# Altium schematic sheet mcu.SchDoc: MCU
size A3; Organization: Altium Limited; Address1: L3, 12a Rodborough Rd; Address2: Frenchs Forest; Address3: NSW; Address4: Australia 2086
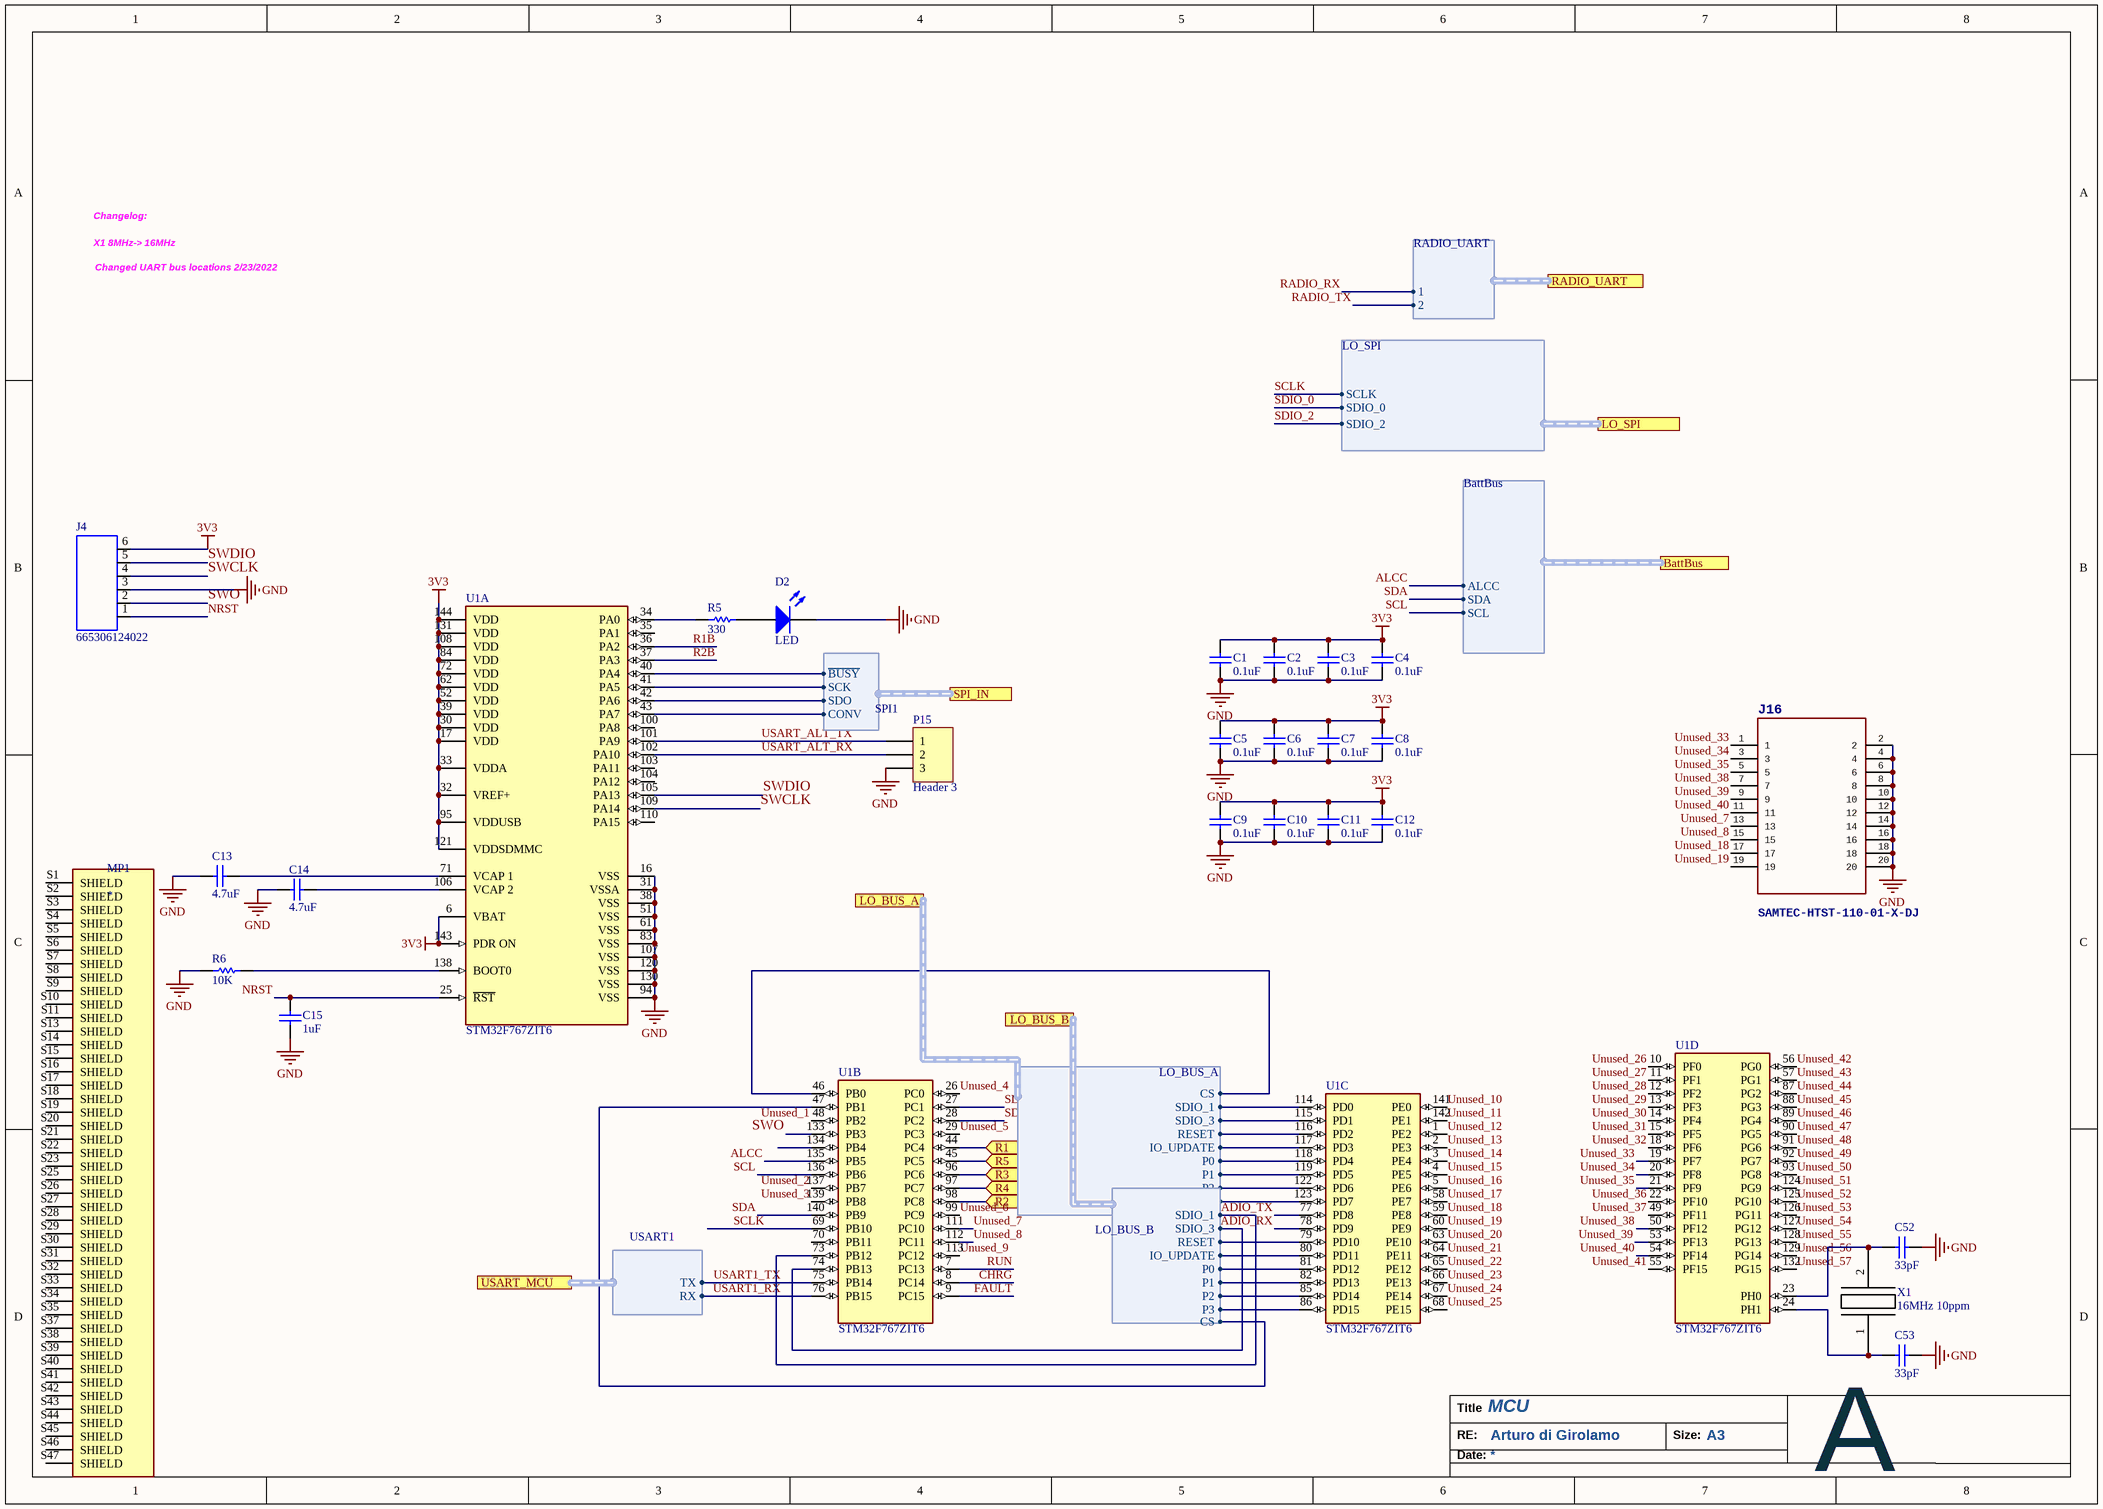
[diagram p0: mcu.SchDoc]

## Parts
C1  0.1uF  [0402_Cap]
C2  0.1uF  [0402_Cap]
C3  0.1uF  [0402_Cap]
C4  0.1uF  [0402_Cap]
C5  0.1uF  [0402_Cap]
C6  0.1uF  [0402_Cap]
C7  0.1uF  [0402_Cap]
C8  0.1uF  [0402_Cap]
C9  0.1uF  [0402_Cap]
C10  0.1uF  [0402_Cap]
C11  0.1uF  [0402_Cap]
C12  0.1uF  [0402_Cap]
C13  4.7uF  [0402_Cap]
C14  4.7uF  [0402_Cap]
C15  1uF  [0402_Cap]
C52  33pF  [0402_Cap]
C53  33pF  [0402_Cap]
D2  LED  [STD_LED]
J4  665306124022  [6pin_we]
J16  SAMTEC-HTST-110-01-X-DJ  [SAMTEC-HTST-110-01-X-D]
MP1  *  [WURTH_36103605S]
P15  Header 3  [HDR1X3]
R5  330  [0402_Res]
R6  10K  [0402_Res]
U1  STM32F767ZIT6  [FP-LQFP144-1A-MFG]  (parts A,B,C,D of 4)
X1  16MHz 10ppm  [XTAL_ECS-160-20-4X]

## Ports
BattBus (harness BattBus), LO_BUS_A (harness LO_BUS_A), LO_BUS_B (harness LO_BUS_B), LO_SPI (harness LO_SPI), R1 (in), R2 (in), R3 (in), R4 (in), R5 (in), RADIO_UART (harness RADIO_UART), SPI_IN (harness SPI1), USART_MCU (harness USART1)

## Harnesses
USART1: TX, RX
SPI1: ~{BUSY}, SCK, CONV, SDO
LO_BUS_A: P2, P1, P0, IO_UPDATE, RESET, SDIO_3, SDIO_1, P3, CS
LO_BUS_B: P2, P1, P0, IO_UPDATE, RESET, SDIO_3, SDIO_1, CS, P3
RADIO_UART: 1, 2
LO_SPI: SDIO_2, SDIO_0, SCLK
BattBus: ALCC, SDA, SCL

## Nets
3V3: C1.2 C2.2 C3.2 C4.2 C5.2 C6.2 C7.2 C8.2 C9.2 C10.2 C11.2 C12.2 J4.6 U1.6(VBAT) U1.17(VDD) U1.30(VDD) U1.32(VREF+) U1.33(VDDA) U1.39(VDD) U1.52(VDD) U1.62(VDD) U1.72(VDD) U1.84(VDD) U1.95(VDDUSB) U1.108(VDD) U1.121(VDDSDMMC) U1.131(VDD) U1.143(PDR_ON) U1.144(VDD)
GND: C1.1 C2.1 C3.1 C4.1 C5.1 C6.1 C7.1 C8.1 C9.1 C10.1 C11.1 C12.1 C13.1 C14.1 C15.1 C52.2 C53.2 D2.2 J4.3 J16.2 J16.4 J16.6 J16.8 J16.10 J16.12 J16.14 J16.16 J16.18 J16.20 P15.3 R6.1 U1.16(VSS) U1.31(VSSA) U1.38(VSS) U1.51(VSS) U1.61(VSS) U1.83(VSS) U1.94(VSS) U1.107(VSS) U1.120(VSS) U1.130(VSS)
ALCC: U1.135(PB5) ; port BattBus.ALCC
CHRG: U1.8(PC14)
FAULT: U1.9(PC15)
NRST: C15.2 J4.1 U1.25(~{RST})
R1: U1.44(PC4) ; port R1
R1B: U1.36(PA2)
R2: U1.98(PC8) ; port R2
R2B: U1.37(PA3)
R3: U1.96(PC6) ; port R3
R4: U1.97(PC7) ; port R4
R5: U1.45(PC5) ; port R5
RADIO_RX: U1.78(PD9) ; port RADIO_UART.1
RADIO_TX: U1.77(PD8) ; port RADIO_UART.2
RUN: U1.7(PC13)
SCL: U1.136(PB6) ; port BattBus.SCL
SCLK: U1.69(PB10) ; port LO_SPI.SCLK
SDA: U1.140(PB9) ; port BattBus.SDA
SDIO_0: U1.27(PC1) ; port LO_SPI.SDIO_0
SDIO_2: U1.28(PC2) ; port LO_SPI.SDIO_2
SWCLK: J4.4 U1.109(PA14)
SWDIO: J4.5 U1.105(PA13)
SWO: J4.2 U1.133(PB3)
Unused_1: U1.48(PB2)
Unused_2: U1.137(PB7)
Unused_3: U1.139(PB8)
Unused_4: U1.26(PC0)
Unused_5: U1.29(PC3)
Unused_6: U1.99(PC9)
Unused_7: J16.13 U1.111(PC10)
Unused_8: J16.15 U1.112(PC11)
Unused_9: U1.113(PC12)
Unused_10: U1.141(PE0)
Unused_11: U1.142(PE1)
Unused_12: U1.1(PE2)
Unused_13: U1.2(PE3)
Unused_14: U1.3(PE4)
Unused_15: U1.4(PE5)
Unused_16: U1.5(PE6)
Unused_17: U1.58(PE7)
Unused_18: J16.17 U1.59(PE8)
Unused_19: J16.19 U1.60(PE9)
Unused_20: U1.63(PE10)
Unused_21: U1.64(PE11)
Unused_22: U1.65(PE12)
Unused_23: U1.66(PE13)
Unused_24: U1.67(PE14)
Unused_25: U1.68(PE15)
Unused_26: U1.10(PF0)
Unused_27: U1.11(PF1)
Unused_28: U1.12(PF2)
Unused_29: U1.13(PF3)
Unused_30: U1.14(PF4)
Unused_31: U1.15(PF5)
Unused_32: U1.18(PF6)
Unused_33: J16.1 U1.19(PF7)
Unused_34: J16.3 U1.20(PF8)
Unused_35: J16.5 U1.21(PF9)
Unused_36: U1.22(PF10)
Unused_37: U1.49(PF11)
Unused_38: J16.7 U1.50(PF12)
Unused_39: J16.9 U1.53(PF13)
Unused_40: J16.11 U1.54(PF14)
Unused_41: U1.55(PF15)
Unused_42: U1.56(PG0)
Unused_43: U1.57(PG1)
Unused_44: U1.87(PG2)
Unused_45: U1.88(PG3)
Unused_46: U1.89(PG4)
Unused_47: U1.90(PG5)
Unused_48: U1.91(PG6)
Unused_49: U1.92(PG7)
Unused_50: U1.93(PG8)
Unused_51: U1.124(PG9)
Unused_52: U1.125(PG10)
Unused_53: U1.126(PG11)
Unused_54: U1.127(PG12)
Unused_55: U1.128(PG13)
Unused_56: U1.129(PG14)
Unused_57: U1.132(PG15)
USART1_RX: U1.76(PB15) ; port USART_MCU.RX
USART1_TX: U1.75(PB14) ; port USART_MCU.TX
USART_ALT_RX: P15.2 U1.102(PA10)
USART_ALT_TX: P15.1 U1.101(PA9)
NetC13_2: C13.2 U1.71(VCAP_1)
NetC14_2: C14.2 U1.106(VCAP_2)
NetC52_1: C52.1 U1.23(PH0) X1.2
NetC53_1: C53.1 U1.24(PH1) X1.1
NetD2_1: D2.1 R5.2
NetR5_1: R5.1 U1.34(PA0)
NetR6_2: R6.2 U1.138(BOOT0)
NetU1_40: U1.40(PA4) ; port SPI_IN.~{BUSY}
NetU1_41: U1.41(PA5) ; port SPI_IN.SCK
NetU1_42: U1.42(PA6) ; port SPI_IN.SDO
NetU1_43: U1.43(PA7) ; port SPI_IN.CONV
NetU1_46: U1.46(PB0) ; port LO_BUS_A.CS
NetU1_47: U1.47(PB1) ; port LO_BUS_B.CS
NetU1_73: U1.73(PB12) ; port LO_BUS_B.SDIO_1
NetU1_74: U1.74(PB13) ; port LO_BUS_B.SDIO_3
NetU1_79: U1.79(PD10) ; port LO_BUS_B.RESET
NetU1_80: U1.80(PD11) ; port LO_BUS_B.IO_UPDATE
NetU1_81: U1.81(PD12) ; port LO_BUS_B.P0
NetU1_82: U1.82(PD13) ; port LO_BUS_B.P1
NetU1_85: U1.85(PD14) ; port LO_BUS_B.P2
NetU1_86: U1.86(PD15) ; port LO_BUS_B.P3
NetU1_114: U1.114(PD0) ; port LO_BUS_A.SDIO_1
NetU1_115: U1.115(PD1) ; port LO_BUS_A.SDIO_3
NetU1_116: U1.116(PD2) ; port LO_BUS_A.RESET
NetU1_117: U1.117(PD3) ; port LO_BUS_A.IO_UPDATE
NetU1_118: U1.118(PD4) ; port LO_BUS_A.P0
NetU1_119: U1.119(PD5) ; port LO_BUS_A.P1
NetU1_122: U1.122(PD6) ; port LO_BUS_A.P2
NetU1_123: U1.123(PD7) ; port LO_BUS_A.P3

Not connected (* = marked no-connect by the designer): MP1 S1(SHIELD) S2(SHIELD) S3(SHIELD) S4(SHIELD) S5(SHIELD) S6(SHIELD) S7(SHIELD) S8(SHIELD) S9(SHIELD) S10(SHIELD) S11(SHIELD) S13(SHIELD) S14(SHIELD) S15(SHIELD) S16(SHIELD) S17(SHIELD) S18(SHIELD) S19(SHIELD) S20(SHIELD) S21(SHIELD) S22(SHIELD) S23(SHIELD) S25(SHIELD) S26(SHIELD) S27(SHIELD) S28(SHIELD) S29(SHIELD) S30(SHIELD) S31(SHIELD) S32(SHIELD) S33(SHIELD) S34(SHIELD) S35(SHIELD) S37(SHIELD) S38(SHIELD) S39(SHIELD) S40(SHIELD) S41(SHIELD) S42(SHIELD) S43(SHIELD) S44(SHIELD) S45(SHIELD) S46(SHIELD) S47(SHIELD); U1 35(PA1) 70(PB11) 100(PA8) 103(PA11) 104(PA12) 110(PA15) 134(PB4)

## Notes on the sheet
- Changelog:
- X1 8MHz-> 16MHz
- Changed UART bus locations 2/23/2022
- Title
- Date:
- RE:
- Arturo di Girolamo
- Size:
- A3
- A

## Library data of the parts
C1-C12 = CL21B104KACNNNC: Capacitor, 0.1uF, 0805; Value: .01uf; ASYPN: 0402YC104KAT2A; MFGPN: CL21B104KACNNNC; Parameter 1: *
C13 C14 = CL21A475KAQNNNE: Capacitor, 4.7uF, 0805; Value: .01uf; ASYPN: AMK105ABJ475MV-F; MFGPN: CL21A475KAQNNNE
C15 = CL21B105KBFNFNE: Capacitor, 1uF, 0805; Value: .01uf; ASYPN: CGB2A3JB0G105M033BB; MFGPN: CL21B105KBFNFNE
C52 C53 = CC0805GRNPO9BN330: Capacitor, 33pF, 0805; Value: .01uf; ASYPN: 04025C330JAT2A; MFGPN: CC0805GRNPO9BN330
D2 = LNJ037X8ARA: Typical LED; ASYPN: LO R976-PS-1; MFGPN: LNJ037X8ARA
J4 = 6pin_WE: Connector Header Surface Mount 6 position 0.039 (1.00mm); MF: WÃ¼rth Elektronik; Check_prices: https://www.snapeda.com/parts/665306124022/W%C3%BCrth%20Elektronik/view-part/1276936/?ref=eda; Price: None; Value: *; Availability: Warning; Package: None; Purchase-URL: https://pricing.snapeda.com/search/part/665306124022/?ref=eda; MP: 665306124022; SnapEDA_Link: https://www.snapeda.com/parts/665306124022/W%C3%BCrth%20Elektronik/view-part/1276936/?ref=snap; ASYPN: 665306124022
J16 = SAMTEC-HTST-110-01-X-DJ: GateName_1: A; SymbolName_1: SAMTEC-HTST-110-01-X-DA; DeviceName: J; LibraryName: SAMTEC-HTST-110-01-X-D; DeviceSetName: SAMTEC-HTST-110-01-X-D; Package: SAMTEC-HTST-110-01-X-D
MP1 = 36103605S: RF SHIELD 2.362" SURFACE MOUNT; Package: None; Price: None; Value: *; MP: 36103605S; Availability: Unavailable; ASYPN: 36103605S
P15 = Header 3: Header, 3-Pin; LatestRevisionDate: 17-Jul-2002; LatestRevisionNote: Re-released for DXP Platform.; Publisher: Altium Limited
R5 = RL1220S-R33-F: 330 1% 1/3W; Value: 1K; ASYPN: RC0402JR-07330RL; MFGPN: RL1220S-R33-F
R6 = RNCP0805FTD10K0: 10K 1% 1/4W; Value: 1K; ASYPN: RMCF0402FT10K0; MFGPN: RNCP0805FTD10K0
U1 = CMP-12105-000074-1: IC MCU 32BIT 2MB FLASH 144LQFP; Manufacturer: STMicroelectronics; Ram Size: 512KBytes; Number Of I/Os: 114; Core Architecture: ARM Cortex-M7; Memory Size: 2048KBytes; Standoff Height: 0.05mm; Number Of Adc Channels: 24; Max Supply Voltage: 3.6V; Number Of Pwm Channels: 4; Min Supply Voltage: 1.7V; Max Junction Temp: +105°C; Number Of Timers/Counters: 15; Number Of Usb Channels: 1; Interface: I2C,SPI,UART,USART,EBI/EMI,CAN,USB,LIN,IrDA,Ethernet,I2S; Frequency: 216MHz; Data Bus Width: 32bits; Number Of Spi Channels: 6; Number Of A/D Converters: 3; Octopart: https://octopart.com/stm32f767zit6-stmicroelectronics-70527068; Category: IC; Device Class L2: Embedded Processors and Controllers; Package: LQFP144-1A; RoHS: TRUE; Digikey Description: IC MCU 32BIT 2MB FLASH 144LQFP; ComponentLink2Description: Datasheet; Automotive: No; Mouser Description: ARM Microcontrollers - MCU High-performance and DSP with FPU, ARM Cortex-M7 MCU with 2 Mbytes Flash, 216 MHz CPU, Art Accelerator, L1 cache, SDRAM,; Ambient Temperature Range Low: -40°C; Ambient Temperature Range High: +85°C; Memory Type: FLASH; ComponentLink2URL: https://www.st.com/resource/en/datasheet/stm32f767zi.pdf; Number Of Uart Channels: 4; Temperature: -40°C to +85°C; Device Class L3: Microcontrollers; Device Class L1: Integrated Circuits (ICs); Temperature Range Low: -40°C; Temperature Range High: +85°C; Lead Free: Yes; Number Of I2C Channels: 4; Number Of Ethernet Channels: 1; Height: 1.6mm; Number Of Cores: 1; Manufacturer Part Number: STM32F767ZIT6; Ipc Land Pattern Name: QFP50P2200X2200X160-144; ASYPN: STM32F767ZIT6
X1 = 9B-8.000MEEJ-B